# EAGLE design Radio (EAGLE 8.2.0)
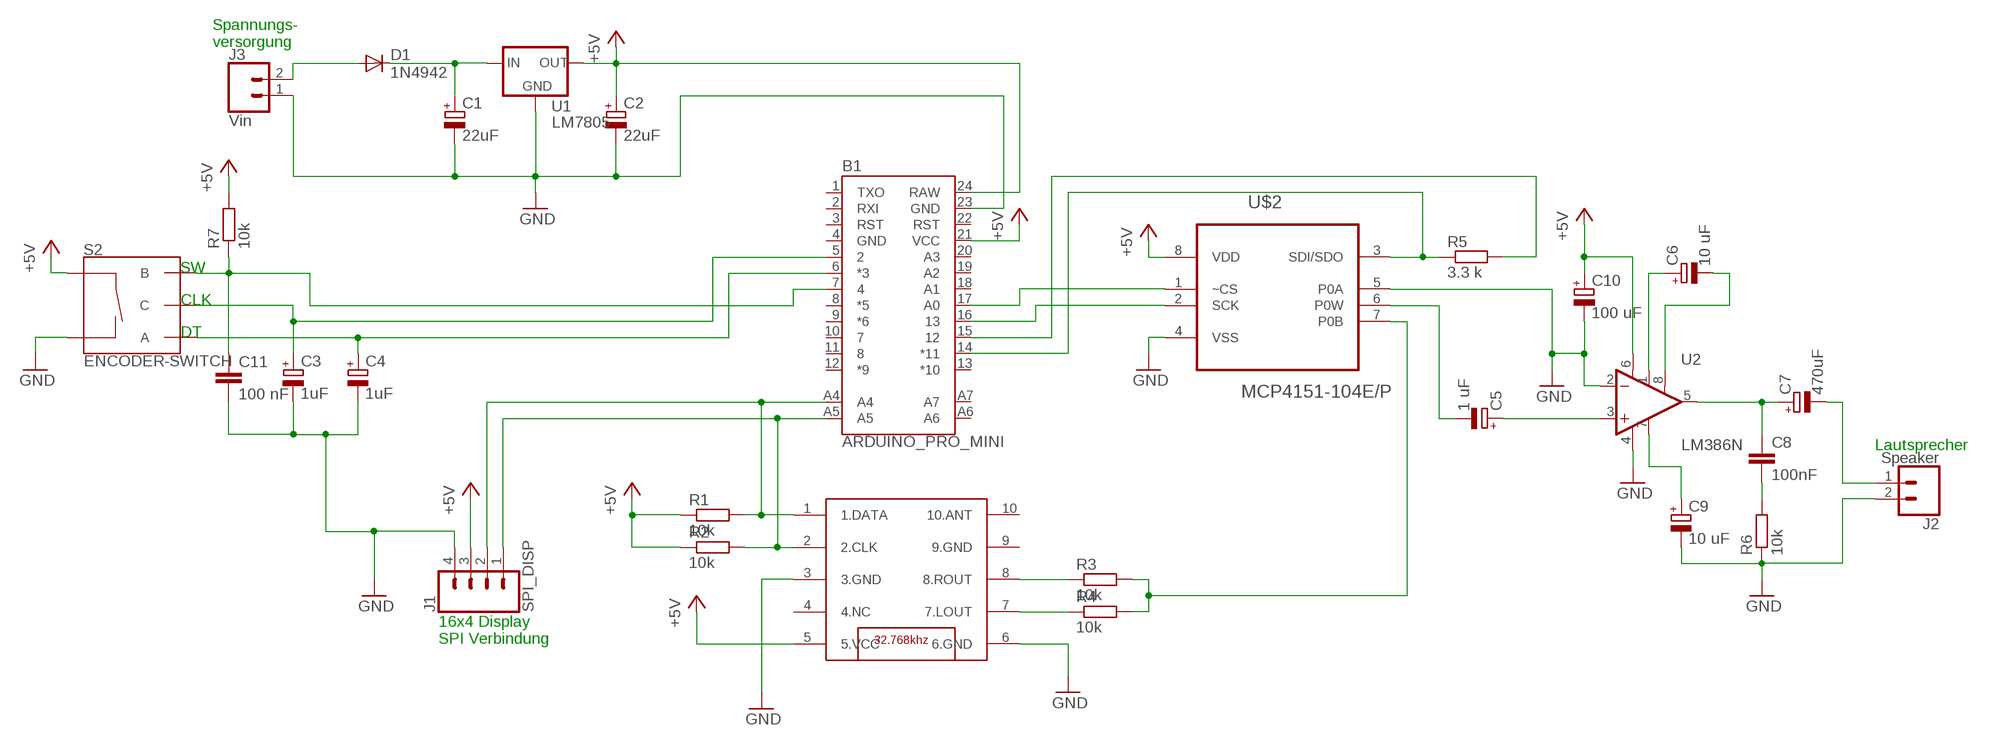
[diagram p0: schematic, sheet 1]

## Parts
B1  ARDUINO_PRO_MINI  [ARDUINO_PRO_MINI]
C1  22uF  CPOL-EUE2,5-6E  [E2,5-6E]
C2  22uF  CPOL-EUE2,5-6E  [E2,5-6E]
C3  1uF  CPOL-EUE5-10.5  [E5-10,5]
C4  1uF  CPOL-EUE5-10.5  [E5-10,5]
C5  1 uF  CPOL-EUE5-10.5  [E5-10,5]
C6  10 uF  CPOL-EUE5-10.5  [E5-10,5]
C7  470uF  CPOL-EUE5-10.5  [E5-10,5]
C8  100nF  C-EU025-040X050  [C025-040X050]
C9  10 uF  CPOL-EUE5-10.5  [E5-10,5]
C10  100 uF  CPOL-EUE5-10.5  [E5-10,5]
C11  100 nF  C-EU025-040X050  [C025-040X050]
D1  1N4942  [DO41-10]
J1  SPI_DISP  CONN_04  [1X04]
J2  Speaker  CONN_02  [1X02]
J3  Vin  CONN_02  [1X02]
R1  10k  R-EU_0207/10  [0207/10]
R2  10k  R-EU_0207/10  [0207/10]
R3  10k  R-EU_0207/10  [0207/10]
R4  10k  R-EU_0207/10  [0207/10]
R5  3.3 k  R-EU_0207/10  [0207/10]
R6  10k  R-EU_0207/10  [0207/10]
R7  10k  R-EU_0207/10  [0207/10]
S2  ENCODER-SWITCH  [ROTARY_ENC_PLAIN]
U1  LM7805  V_REG_78XXSIDE  [78XXL]
U2  LM386N  LM386  [DIP08]
U$1  TEA5767  [TJ-102BC]
U$2  MCP4151-104E/P  [DIP254P762X533-8]

## Nets
+5V: B1.21(VCC) B1.24(RAW) C2.+ C10.+ J1.3 R1.1 R2.1 R7.2 S2.SW+ U1.OUT U2.6(V+) U$1.5(5.VCC) U$2.8(VDD)
GND: B1.23(GND) C1.- C2.- C3.- C4.- C9.- C10.- C11.2 J1.4 J2.2 J3.1 R6.1 S2.SW- U1.GND U2.2(-IN) U2.4(V-) U$1.3(3.GND) U$1.6(6.GND) U$2.4(VSS) U$2.5(P0A)
N$1: C1.+ D1.C U1.IN
N$2: B1.A4 J1.2 R1.2 U$1.1(1.DATA)
N$5: B1.A5 J1.1 R2.2 U$1.2(2.CLK)
N$6: B1.7 C11.1 R7.1 S2.B
N$7: R3.1 U$1.8(8.ROUT)
N$8: R4.1 U$1.7(7.LOUT)
N$9: R3.2 R4.2 U$2.7(P0B)
N$10: C8.2 R6.2
N$11: B1.14(*11) R5.1 U$2.3(SDI/SDO)
N$12: B1.17(A0) U$2.1(~CS)
N$13: B1.16 U$2.2(SCK)
N$14: B1.15 R5.2
N$15: C5.- U$2.6(P0W)
N$16: C5.+ U2.3(+IN)
N$17: C6.+ U2.1(GAIN)
N$18: C6.- U2.8(GAIN)
N$19: C7.+ C8.1 U2.5(OUT)
N$20: D1.A J3.2
N$21: C9.+ U2.7(BP)
N$22: B1.5 C3.+ S2.C
N$23: B1.6(*3) C4.+ S2.A
N$25: C7.- J2.1
Unconnected: B1.1(TXO) B1.2(RXI) B1.3(RST) B1.8(*5) B1.9(*6) B1.10 B1.11 B1.12(*9) B1.13(*10) B1.18(A1) B1.19(A2) B1.20(A3) B1.22(RST) B1.A6 B1.A7 U$1.4(4.NC) U$1.9(9.GND) U$1.10(10.ANT)

## Notes on the sheet
- Spannungs-
  versorgung
- SW
- CLK
- DT
- Lautsprecher
- 16x4 Display
  SPI Verbindung

## Power pins joined to a net without a drawn wire
GND: B1.4(GND)

## Library data of the parts
B1 = SparkFun-Boards:ARDUINO_PRO_MINI: SparkFun Pro Mini Pro Mini compatible footprint. Dimensions: 0.7 x 1.3" PCB Thickness: 0.8mm SparkFun Products: 3.3V/8MHz <https://www.sparkfun.com/products/11114> 5V/16MHz <https://www.sparkfun.com/products/11113>
C1-C7 C9 C10 = resistor:CPOL-EU: POLARIZED CAPACITOR, European symbol
C8 C11 = resistor:C-EU: CAPACITOR, European symbol
D1 = diode:1N4942: DIODE 1.0 A, 200 V, 150 ns
J1 = SparkFun-Connectors:CONN_04: Multi connection point. Often used as Generic Header-pin footprint for 0.1 inch spaced/style header connections On any of the 0.1 inch spaced packages, you can populate with these: Break Away Headers - Straight <https://www.sparkfun.com/products/116> (PRT-00116) Break Away Male Headers - Right Angle <https://www.sparkfun.com/products/553> (PRT-00553) Female Headers <https://www.sparkfun.com/products/115> (PRT-00115) Break Away Headers - Machine Pin <https://www.sparkfun.com/products/117> (PRT-00117) Break Away Female Headers - Swiss Machine Pin <https://www.sparkfun.com/products/743> (PRT-00743) For SCREWTERMINALS and SPRING TERMINALS visit here: Screw Terimnals on SparkFun.com <https://www.sparkfun.com/search/results?term=Screw+Terminals> (5mm/3.5mm/2.54mm spacing) This device is also useful as a general connection point to wire up your design to another part of your project. Our various solder wires solder well into these plated through hole pads. Hook-Up Wire - Assortment (Stranded, 22 AWG) <https://www.sparkfun.com/products/11375> (PRT-11375) Hook-Up Wire - Assortment (Solid Core, 22 AWG) <https://www.sparkfun.com/products/11367> (PRT-11367) View the entire wire category on our website here <https://www.sparkfun.com/categories/141> Special notes: Molex polarized connector foot print use with SKU : PRT-08231 with associated crimp pins and housings. 1MM SMD Version SKU: PRT-10208; PROD_ID: CONN-09696
J2 J3 = SparkFun-Connectors:CONN_02: Multi connection point. Often used as Generic Header-pin footprint for 0.1 inch spaced/style header connections On any of the 0.1 inch spaced packages, you can populate with these: Break Away Headers - Straight <https://www.sparkfun.com/products/116> (PRT-00116) Break Away Male Headers - Right Angle <https://www.sparkfun.com/products/553> (PRT-00553) Female Headers <https://www.sparkfun.com/products/115> (PRT-00115) Break Away Headers - Machine Pin <https://www.sparkfun.com/products/117> (PRT-00117) Break Away Female Headers - Swiss Machine Pin <https://www.sparkfun.com/products/743> (PRT-00743) For SCREWTERMINALS and SPRING TERMINALS visit here: Screw Terimnals on SparkFun.com <https://www.sparkfun.com/search/results?term=Screw+Terminals> (5mm/3.5mm/2.54mm spacing) This device is also useful as a general connection point to wire up your design to another part of your project. Our various solder wires solder well into these plated through hole pads. Hook-Up Wire - Assortment (Stranded, 22 AWG) <https://www.sparkfun.com/products/11375> (PRT-11375) Hook-Up Wire - Assortment (Solid Core, 22 AWG) <https://www.sparkfun.com/products/11367> (PRT-11367) View the entire wire category on our website here <https://www.sparkfun.com/categories/141> Special notes: Molex polarized connector foot print use with: PRT-08233 with associated crimp pins and housings. 2.54_SCREWTERM for use with PRT-10571. 3.5mm Screw Terminal footprints for PRT-08084 5mm Screw Terminal footprints for use with PRT-08432
R1-R7 = resistor:R-EU_: RESISTOR, European symbol
S2 = SparkFun-Switches:ENCODER-SWITCH: Rotary Encoder w/ Select Switch Encoders rotate similarly to potentiometers, but they’re different from potentiometers in that an encoder has full rotation without limits. They output gray code so that you can tell how much and in which direction the encoder has been turned. This encoder includes a push-down select switch built into the shaft. SparkFun Products Rotary Encoder <https://www.sparkfun.com/products/9117> (COM-09117); SF_SKU: COM-09117
U1 = SparkFun-IC-Power:V_REG_78XX: Voltage Regulator Standard 78xx regulator. IGO (Input Ground Output). Spark Fun Electronics SKU : COM-00107
U2 = SparkFun-IC-Amplifiers:LM386: low voltage audio power amplifier SparkFun Products FabFM Radio Kit <https://www.sparkfun.com/products/11043> (KIT-11043); PROD_ID: IC-10899
U$1 = TEA5767:TEA5767
U$2 = Microchip_By_element14_Batch_1:MCP4151-104E/P: Digital POT; MPN: MCP4151-104E/P; OC_FARNELL: 1840795; OC_NEWARK: 77M2686; PACKAGE: DIP-8; SUPPLIER: Microchip

## Board
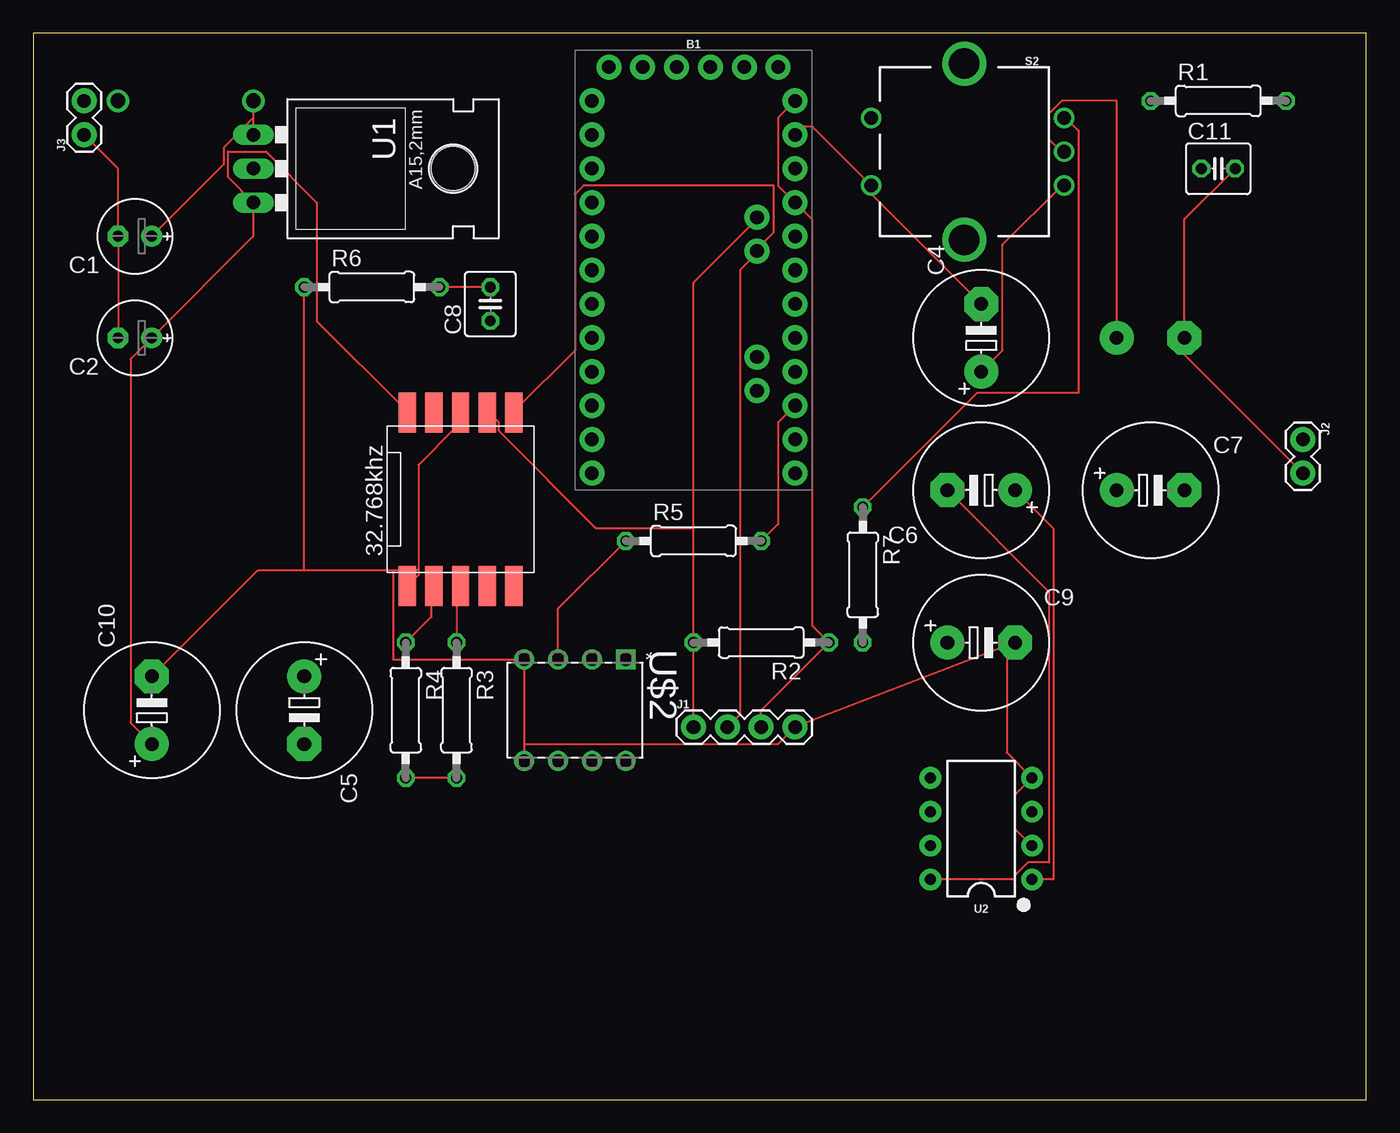
[diagram p1: board, top side]
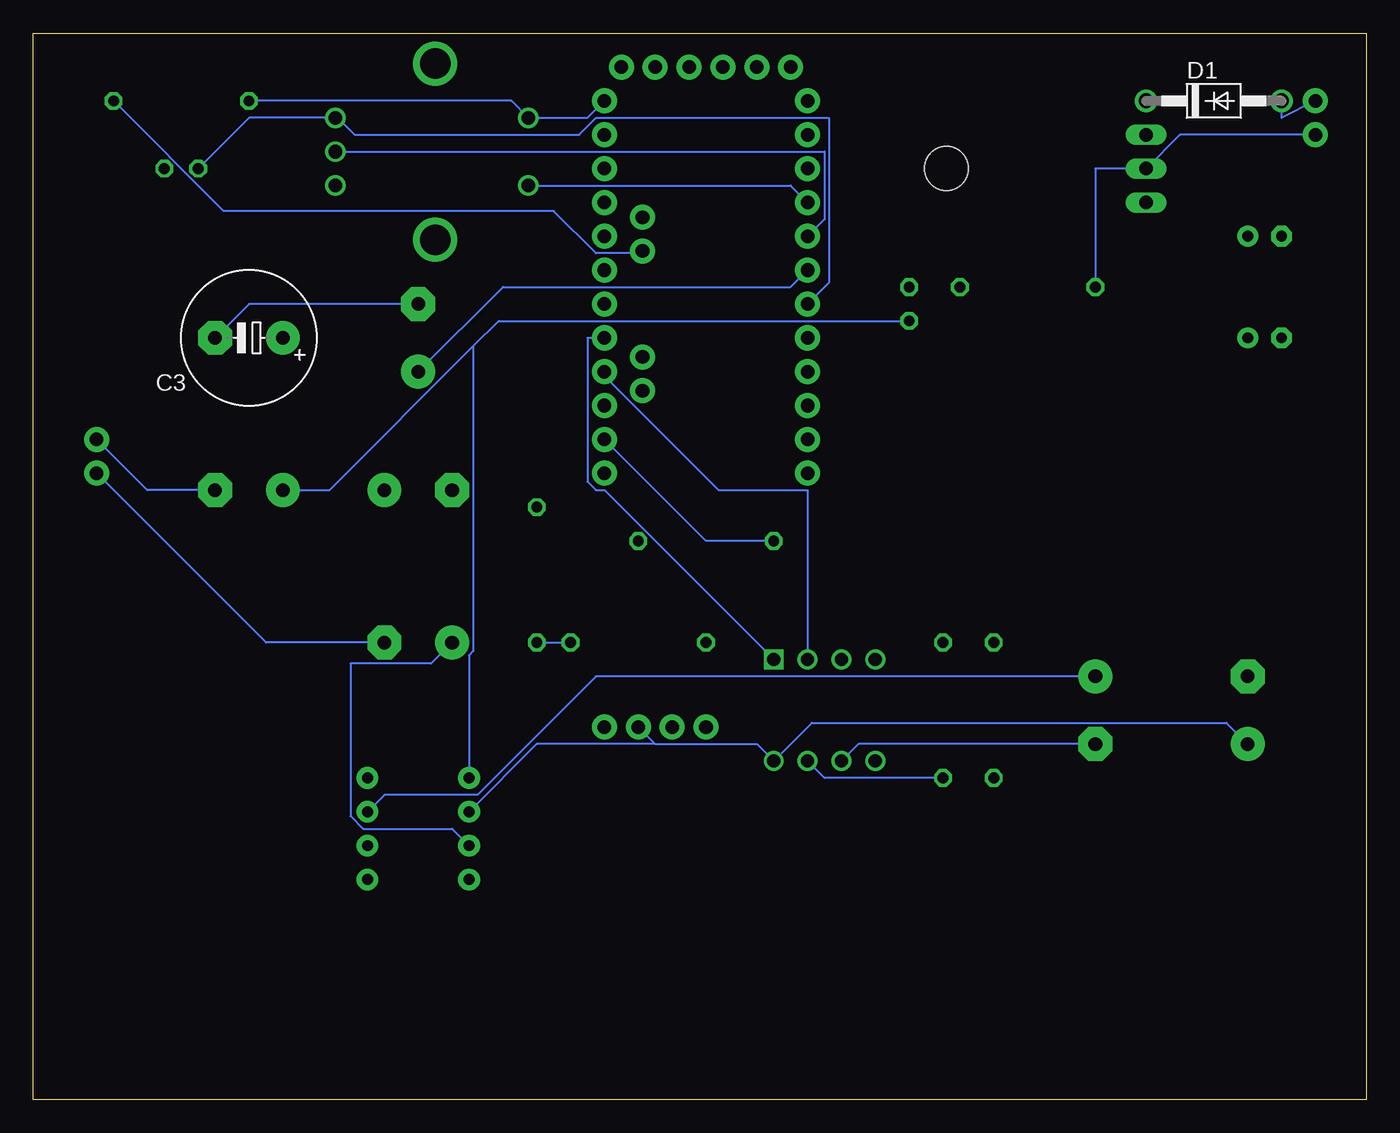
[diagram p2: board, bottom side, seen from below]

Size 100 x 80 mm. Coordinates in mm from the lower left corner, seen from the top.
Outline: 0,0 100,0 100,80 0,80 0,0
Copper layers (1*16): Top 0.035mm / dielectric 1.5mm / Bottom 0.035mm
Design rules "default": minimum track width 6mil, minimum drill 0.35mm, track to track 6mil, track to pad 6mil, pad to pad 6mil, via to via 6mil, smd to smd 6mil, copper to edge 40mil, drill to drill 6mil, minimum pad ring 10mil, minimum via ring 8mil, stop-mask expansion 4mil, vias tented up to drill 0mil, thermal gap 10mil

### Footprints (pad centres in the part's own frame; a part is rotated, then mirrored left to right if it is on the bottom)
ARDUINO_PRO_MINI = drill 1.016 pad 1.88: 1 -7.62,12.7; 2 -7.62,10.16; 3 -7.62,7.62; 4 -7.62,5.08; 5 -7.62,2.54; 6 -7.62,0; 7 -7.62,-2.54; 8 -7.62,-5.08; 9 -7.62,-7.62; 10 -7.62,-10.16; 11 -7.62,-12.7; 12 -7.62,-15.24; 13 7.62,-15.24; 14 7.62,-12.7; 15 7.62,-10.16; 16 7.62,-7.62; 17 7.62,-5.08; 18 7.62,-2.54; 19 7.62,0; 20 7.62,2.54; 21 7.62,5.08; 22 7.62,7.62; 23 7.62,10.16; 24 7.62,12.7; A4 4.763,1.429; A5 4.763,3.969; A6 4.763,-9.049; A7 4.763,-6.509; BLK -6.35,15.24; GND -3.81,15.24; GRN 6.35,15.24; RXI 1.27,15.24; TXO 3.81,15.24; VCC -1.27,15.24
E2,5-6E = drill 0.813 pad 1.575: + -1.27,0 | drill 0.813 pad 1.575 octagon: - 1.27,0
E5-10,5 = drill 1.016 pad 2.54: + -2.54,0 | drill 1.016 pad 2.54 octagon: - 2.54,0
C025-040X050 = drill 0.813 octagon: 1 -1.27,0; 2 1.27,0
DO41-10 = drill 1.118: A 5.08,0; C -5.08,0
1X04 = drill 1.016 pad 1.88: 1 0,0; 2 2.54,0; 3 5.08,0; 4 7.62,0
1X02 = drill 1.016 pad 1.88: 1 0,0; 2 2.54,0
0207/10 = drill 0.813 octagon: 1 -5.08,0; 2 5.08,0
ROTARY_ENC_PLAIN = drill 1.016: A 7.493,-2.54; B 7.493,2.54; C 7.493,0; SW+ -6.985,2.54; SW- -6.985,-2.54 | drill 2.286: P$3 0,6.604; P$4 0,-6.604
78XXL = drill 1.016 long: GND 0,-3.81; IN -2.54,-3.81; OUT 2.54,-3.81 | hole 3.302: 0,11.176
DIP08 = drill 0.813 pad 1.626: 1 -3.81,-3.81; 2 -1.27,-3.81; 3 1.27,-3.81; 4 3.81,-3.81; 5 3.81,3.81; 6 1.27,3.81; 7 -1.27,3.81; 8 -3.81,3.81
TJ-102BC = smd 3 x 1.3: 1 -2,0.5; 2 -2,-1.5; 3 -2,-3.5; 4 -2,-5.5; 5 -2,-7.5; 6 11,-7.5; 7 11,-5.5; 8 11,-3.5; 9 11,-1.5; 10 11,0.5
DIP254P762X533-8 = drill 0.991 square: 1 -7.62,7.62 | drill 0.991: 2 -7.62,5.08; 3 -7.62,2.54; 4 -7.62,0; 5 0,0; 6 0,2.54; 7 0,5.08; 8 0,7.62

### Placement (x,y rotation side)
B1  49.53,62.23 0 top
C1  7.62,64.77 180 top
C2  7.62,57.15 180 top
C3  83.82,57.15 180 bottom
C4  71.12,57.15 90 top
C5  20.32,29.21 270 top
C6  71.12,45.72 180 top
C7  83.82,45.72 0 top
C8  34.29,59.69 90 top
C9  71.12,34.29 0 top
C10  8.89,29.21 90 top
C11  88.9,69.85 0 top
D1  11.43,74.93 0 bottom
J1  49.53,27.94 0 top
J2  95.25,49.53 270 top
J3  3.81,72.39 90 top
R1  88.9,74.93 0 top
R2  54.61,34.29 180 top
R3  31.75,29.21 270 top
R4  27.94,29.21 270 top
R5  49.53,41.91 0 top
R6  25.4,60.96 0 top
R7  62.23,39.37 270 top
S2  69.85,71.12 0 top
U1  20.32,69.85 270 top
U2  71.12,20.32 90 top
U$1  35.56,49.53 270 top
U$2  36.83,25.4 270 top

### Tracks (layer width: path | path; a pad name or v marks a point on that pad's centre or on a via)
+5V
  Top 0.152: U$1.5 27.94,51.75 21.27,58.42 21.27,67.31 17.46,71.12 14.61,71.12 14.61,69.22 U1.OUT 16.51,64.77 C2.+ 7.3,55.56 7.3,28.26 C10.+ | J1.3 54.61,29.21 R2.1 58.42,35.56 58.42,66.04 B1.21 55.88,68.58 55.88,73.66 B1.24
  Bottom 0.152: R7.2 R2.1 | 53.34,26.67 45.72,26.67 U$2.8 41.59,28.26 10.48,28.26 C10.+ | J1.3 53.34,26.67 | U2.6 62.23,26.67 53.34,26.67 | R1.1 64.14,74.93 S2.SW+ 58.42,73.66 B1.24
GND
  Top 0.152: C11.2 86.36,66.04 C3.- 86.36,55.88 J2.2 | B1.23 57.15,73.03 58.42,73.03 S2.SW- 62.87,67.94 C4.- | C2.- C1.- 6.35,69.85 J3.1 | U2.2 73.66,20.32 73.66,22.86 U2.4 73.03,26.04 73.03,33.97 C9.- J1.4 55.88,26.67 36.83,26.67 | 36.83,26.67 U$2.4 26.99,33.02 26.99,39.69 | 36.83,26.67 U$2.5 | 28.89,39.69 28.89,47.62 31.75,50.48 31.75,51.44 U$1.3 | 28.89,39.69 28.89,39.37 28.26,38.73 U$1.6 | C10.- 16.83,39.69 20.32,39.69 | 28.89,39.69 26.99,39.69 | 26.99,39.69 20.32,39.69 | 20.32,39.69 R6.1
  Bottom 0.152: B1.4 43.18,68.58 S2.SW- | C3.- 83.82,59.69 C4.- | R6.1 20.32,69.85 U1.GND 13.97,72.39 J3.1 | J2.2 82.55,34.29 C9.-
N$1
  Top 0.152: D1.C 16.51,73.66 | 16.51,73.66 U1.IN | C1.+ 14.29,70.17 14.29,71.44 16.51,73.66
N$2
  Top 0.152: U$1.1 36.2,51.75 40.64,56.2 40.64,67.94 41.27,68.58 55.56,68.58 55.56,65.09 54.29,63.82 B1.A4 54.29,63.5 53.02,62.23 53.02,28.89 J1.2
  Bottom 0.152: R1.2 85.72,66.67 60.96,66.67 57.78,63.5 54.29,63.5 B1.A4
N$5
  Top 0.152: J1.1 R2.2 49.53,42.86 | 49.53,42.86 42.23,42.86 34.92,50.16 34.92,50.8 34.29,51.44 U$1.2 | 49.53,42.86 49.53,61.28 54.29,66.04 B1.A5
N$6
  Top 0.152: R7.1 70.8,53.02 78.42,53.02 78.42,72.71 77.47,73.66 S2.B
  Bottom 0.152: C11.1 83.82,73.66 S2.B 77.15,73.66 75.88,72.39 59.05,72.39 57.78,73.66 40.32,73.66 40.32,61.28 B1.7
N$7
  Top 0.152: R3.1 31.75,38.42 U$1.8
N$8
  Top 0.152: R4.1 29.84,36.2 29.84,38.42 U$1.7
N$9
  Top 0.152: R3.2 R4.2
  Bottom 0.152: U$2.7 40.64,24.13 R3.2
N$10
  Top 0.152: C8.2 R6.2
N$11
  Top 0.152: R5.1 39.37,36.83 U$2.3
  Bottom 0.152: B1.14 49.53,41.91 R5.1
N$12
  Bottom 0.152: U$2.1 57.15,45.72 57.78,45.72 58.42,46.35 58.42,57.15 B1.17
N$13
  Bottom 0.152: U$2.2 41.91,45.72 48.58,45.72 57.15,54.29 B1.16
N$14
  Top 0.152: R5.2 55.88,43.18 55.88,50.8 B1.15
N$15
  Bottom 0.152: U$2.6 38.1,26.67 C5.-
N$16
  Bottom 0.152: U2.3 73.66,22.86 66.67,22.86 57.78,31.75 C5.+
N$17
  Top 0.152: U2.1 76.52,16.51 76.52,42.86 C6.+
N$18
  Top 0.152: U2.8 73.66,16.51 73.66,16.83 74.61,17.78 76.2,17.78 76.2,38.1 C6.-
N$19
  Bottom 0.152: C8.1 65.09,58.42 66.99,56.52 | 66.99,56.52 77.79,45.72 C7.+ | U2.5 67.31,33.34 66.99,33.66 66.99,56.52
N$20
  Bottom 0.152: D1.A 6.35,73.66 J3.2
N$21
  Bottom 0.152: U2.7 68.58,20.32 75.25,20.32 76.2,21.27 76.2,32.7 70.17,32.7 C9.+
N$22
  Top 0.152: C3.+ 81.28,74.93 77.15,74.93 76.2,73.98 76.2,72.07 77.15,71.12 S2.C
  Bottom 0.152: B1.5 40.64,66.04 40.64,71.12 S2.C
N$23
  Top 0.152: C4.+ 72.71,56.2 72.71,64.14 77.15,68.58 S2.A
  Bottom 0.152: B1.6 43.18,60.96 64.77,60.96 C4.+
N$25
  Bottom 0.152: J2.1 91.44,45.72 C7.-